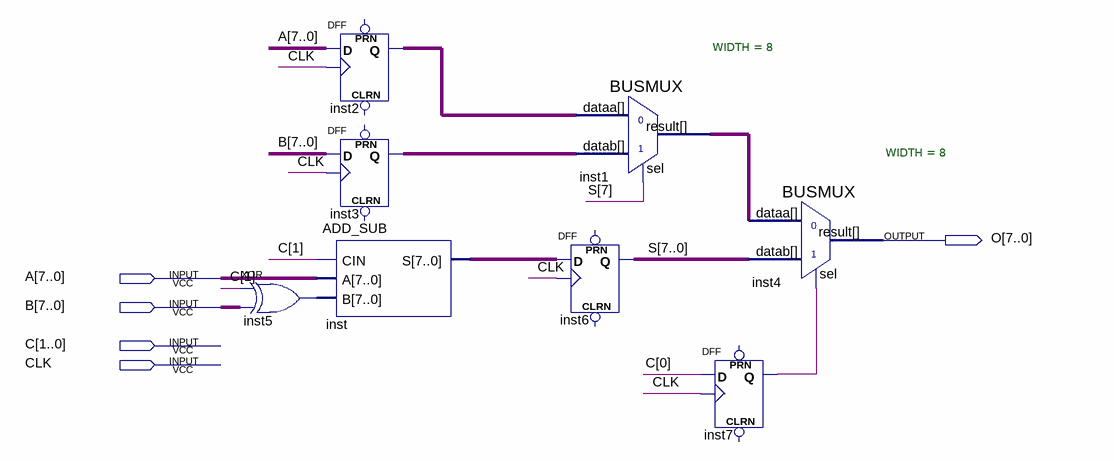
[diagram p0: schematic sheet]
// Quartus schematic ADD_MAX_SUB.bdf as structural Verilog: 8 symbols, 5 pins
module ADD_MAX_SUB (
  input  [7:0] A,
  input  [7:0] B,
  input  [1:0] C,
  input  CLK,
  output [7:0] O
);

  wire inst7_q;
  wire [7:0] inst1_result, inst2_q, inst3_q, inst5_out, inst_s, S;

  assign inst5_out = {8{C[1]}} ^ B;  // XOR inst5, 8 bits wide
  DFF inst2[7:0] (.CLK(CLK), .D(A), .Q(inst2_q));  // open: CLRN, PRN
  DFF inst3[7:0] (.CLK(CLK), .D(B), .Q(inst3_q));  // open: CLRN, PRN
  ADD_SUB inst (.CIN(C[1]), .A(A), .B(inst5_out), .S(inst_s));
  BUSMUX #(.WIDTH(8)) inst1 (.datab(inst3_q), .sel(S[7]), .dataa(inst2_q), .result(inst1_result));
  DFF inst6[7:0] (.CLK(CLK), .D(inst_s), .Q(S));  // open: CLRN, PRN
  BUSMUX #(.WIDTH(8)) inst4 (.datab(S), .sel(inst7_q), .dataa(inst1_result), .result(O));
  DFF inst7 (.CLK(CLK), .D(C[0]), .Q(inst7_q));  // open: CLRN, PRN
endmodule
